# EAGLE schematic axiom_beta_board_100_v0.15_test.94040928 (EAGLE 7.0.0)

## Sheet 1 of 5
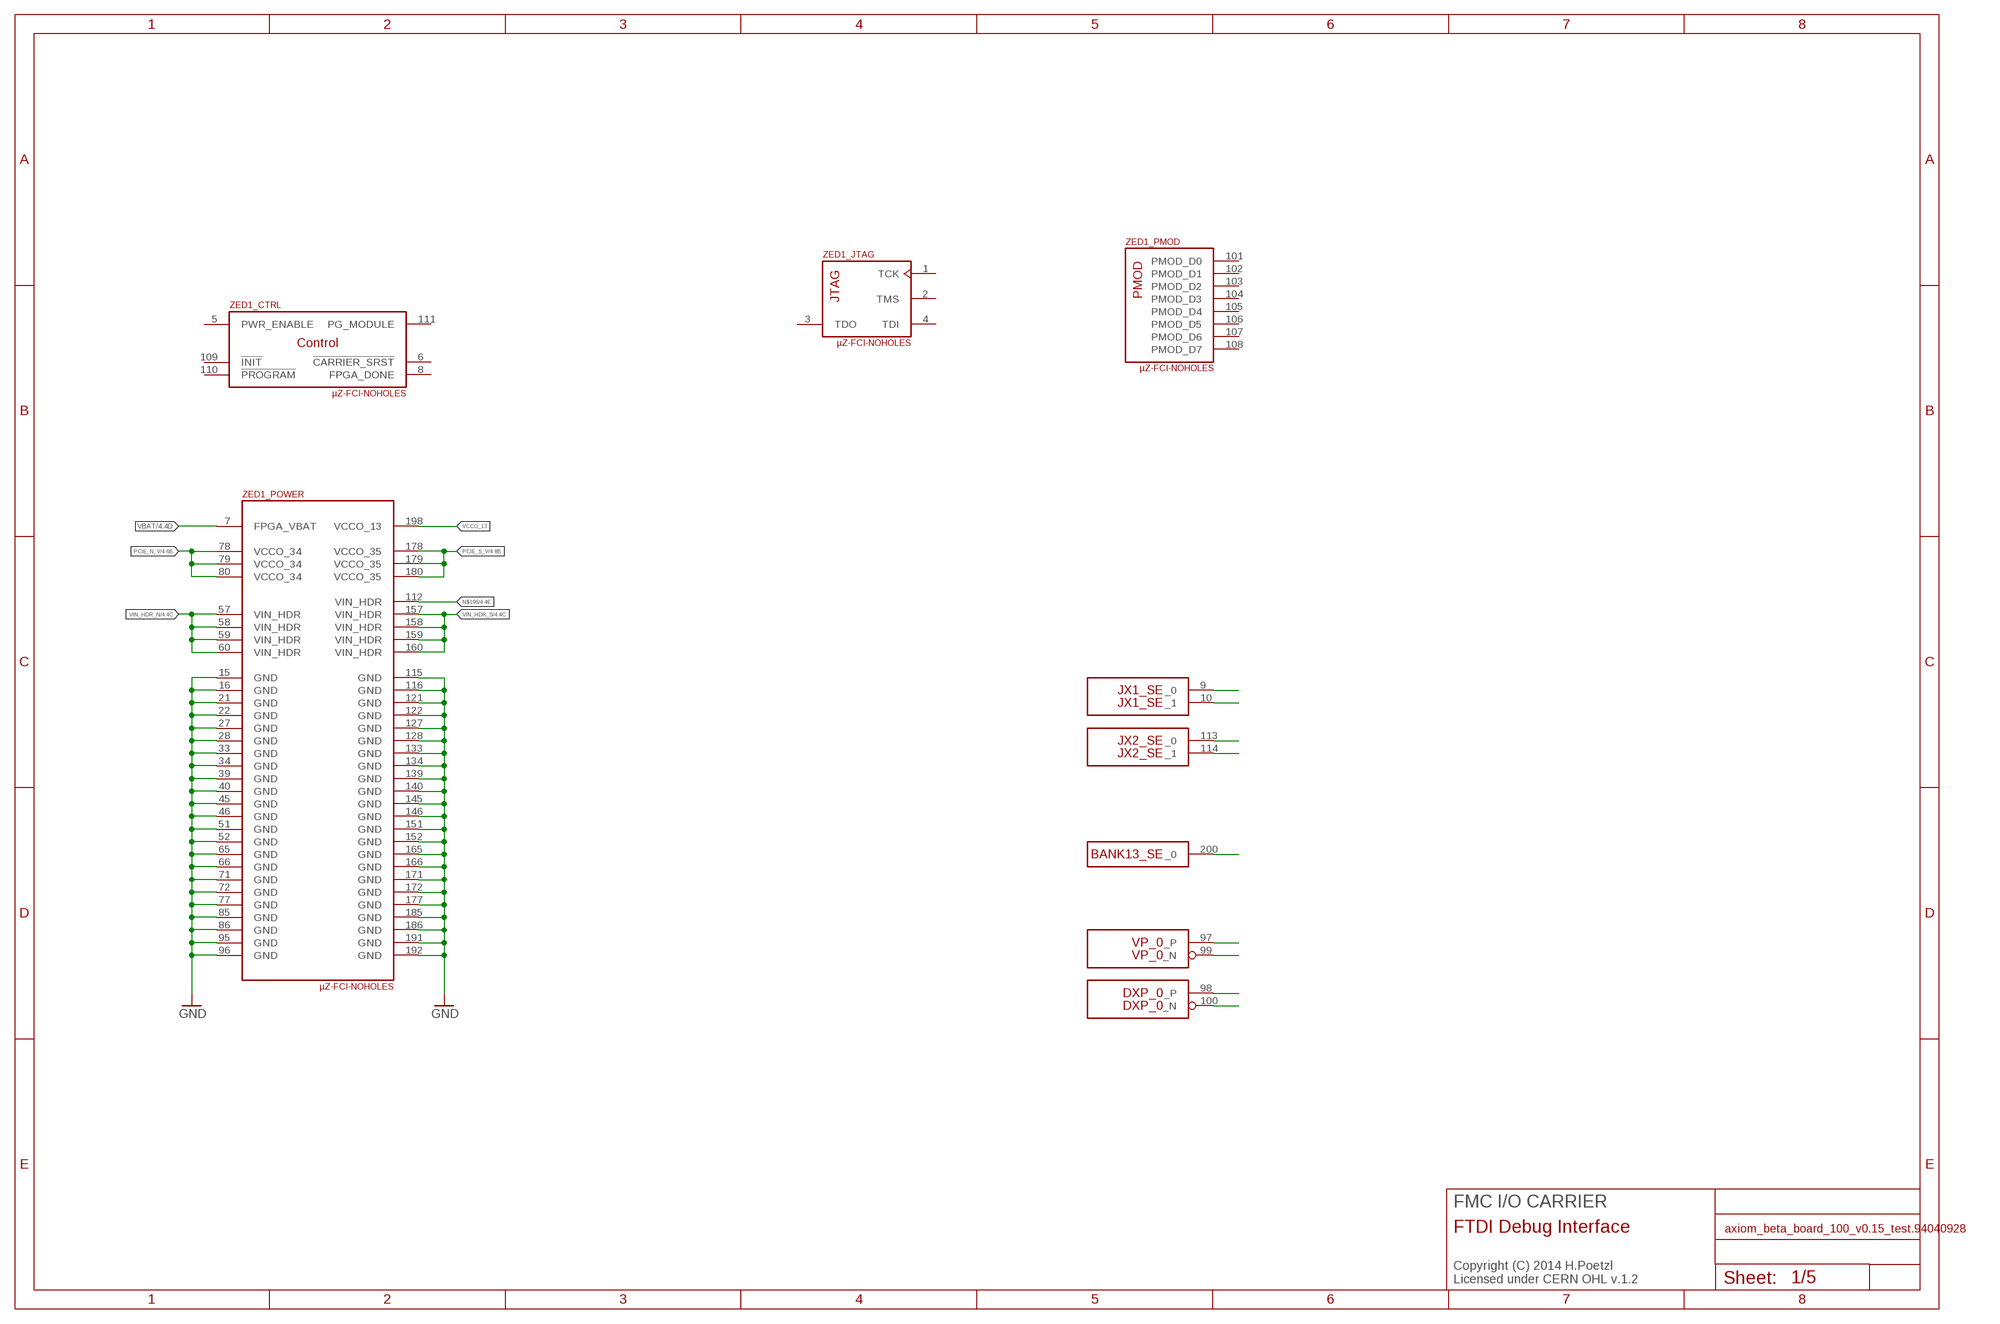
[diagram p0: schematic, sheet 1]

### Parts
ZED1  µZ-FCI-NOHOLES  [µZ-NOHOLES]

### Nets
GND: ZED1.15(_POWER:GND) ZED1.16(_POWER:GND) ZED1.21(_POWER:GND) ZED1.22(_POWER:GND) ZED1.27(_POWER:GND) ZED1.28(_POWER:GND) ZED1.33(_POWER:GND) ZED1.34(_POWER:GND) ZED1.39(_POWER:GND) ZED1.40(_POWER:GND) ZED1.45(_POWER:GND) ZED1.46(_POWER:GND) ZED1.51(_POWER:GND) ZED1.52(_POWER:GND) ZED1.65(_POWER:GND) ZED1.66(_POWER:GND) ZED1.71(_POWER:GND) ZED1.72(_POWER:GND) ZED1.77(_POWER:GND) ZED1.85(_POWER:GND) ZED1.86(_POWER:GND) ZED1.95(_POWER:GND) ZED1.96(_POWER:GND) ZED1.115(_POWER:GND) ZED1.116(_POWER:GND) ZED1.121(_POWER:GND) ZED1.122(_POWER:GND) ZED1.127(_POWER:GND) ZED1.128(_POWER:GND) ZED1.133(_POWER:GND) ZED1.134(_POWER:GND) ZED1.139(_POWER:GND) ZED1.140(_POWER:GND) ZED1.145(_POWER:GND) ZED1.146(_POWER:GND) ZED1.151(_POWER:GND) ZED1.152(_POWER:GND) ZED1.165(_POWER:GND) ZED1.166(_POWER:GND) ZED1.171(_POWER:GND) ZED1.172(_POWER:GND) ZED1.177(_POWER:GND) ZED1.185(_POWER:GND) ZED1.186(_POWER:GND) ZED1.191(_POWER:GND) ZED1.192(_POWER:GND) ; also sheet 3,4,5
N$1: ZED1.9(JX1_SE:_0)
N$46: ZED1.10(JX1_SE:_1)
N$47: ZED1.113(JX2_SE:_0)
N$48: ZED1.114(JX2_SE:_1)
N$49: ZED1.200(BANK13_SE:_0)
N$50: ZED1.97(VP_0:_P)
N$51: ZED1.99(VP_0:_N)
N$52: ZED1.98(DXP_0:_P)
N$53: ZED1.100(DXP_0:_N)
N$106 [power]: ZED1.112(_POWER:VIN_HDR) ; also sheet 4
PCIE_N_V: ZED1.78(_POWER:VCCO_34) ZED1.79(_POWER:VCCO_34) ZED1.80(_POWER:VCCO_34) ; also sheet 4
PCIE_S_V: ZED1.178(_POWER:VCCO_35) ZED1.179(_POWER:VCCO_35) ZED1.180(_POWER:VCCO_35) ; also sheet 4
VBAT: ZED1.7(_POWER:FPGA_VBAT) ; also sheet 4
VCCO_13 [power]: ZED1.198(_POWER:VCCO_13)
VIN_HDR_N [power]: ZED1.57(_POWER:VIN_HDR) ZED1.58(_POWER:VIN_HDR) ZED1.59(_POWER:VIN_HDR) ZED1.60(_POWER:VIN_HDR) ; also sheet 4
VIN_HDR_S [power]: ZED1.157(_POWER:VIN_HDR) ZED1.158(_POWER:VIN_HDR) ZED1.159(_POWER:VIN_HDR) ZED1.160(_POWER:VIN_HDR) ; also sheet 4
Unconnected: ZED1.1(_JTAG:TCK) ZED1.2(_JTAG:TMS) ZED1.3(_JTAG:TDO) ZED1.4(_JTAG:TDI) ZED1.5(_CTRL:PWR_ENABLE) ZED1.6(_CTRL:!CARRIER_SRST) ZED1.8(_CTRL:FPGA_DONE) ZED1.101(_PMOD:PMOD_D0) ZED1.102(_PMOD:PMOD_D1) ZED1.103(_PMOD:PMOD_D2) ZED1.104(_PMOD:PMOD_D3) ZED1.105(_PMOD:PMOD_D4) ZED1.106(_PMOD:PMOD_D5) ZED1.107(_PMOD:PMOD_D6) ZED1.108(_PMOD:PMOD_D7) ZED1.109(_CTRL:!INIT) ZED1.110(_CTRL:!PROGRAM) ZED1.111(_CTRL:PG_MODULE)

### Notes on the sheet
- FMC I/O CARRIER
- FTDI Debug Interface
- Copyright (C) 2014 H.Poetzl
  Licensed under CERN OHL v.1.2

## Sheet 2 of 5
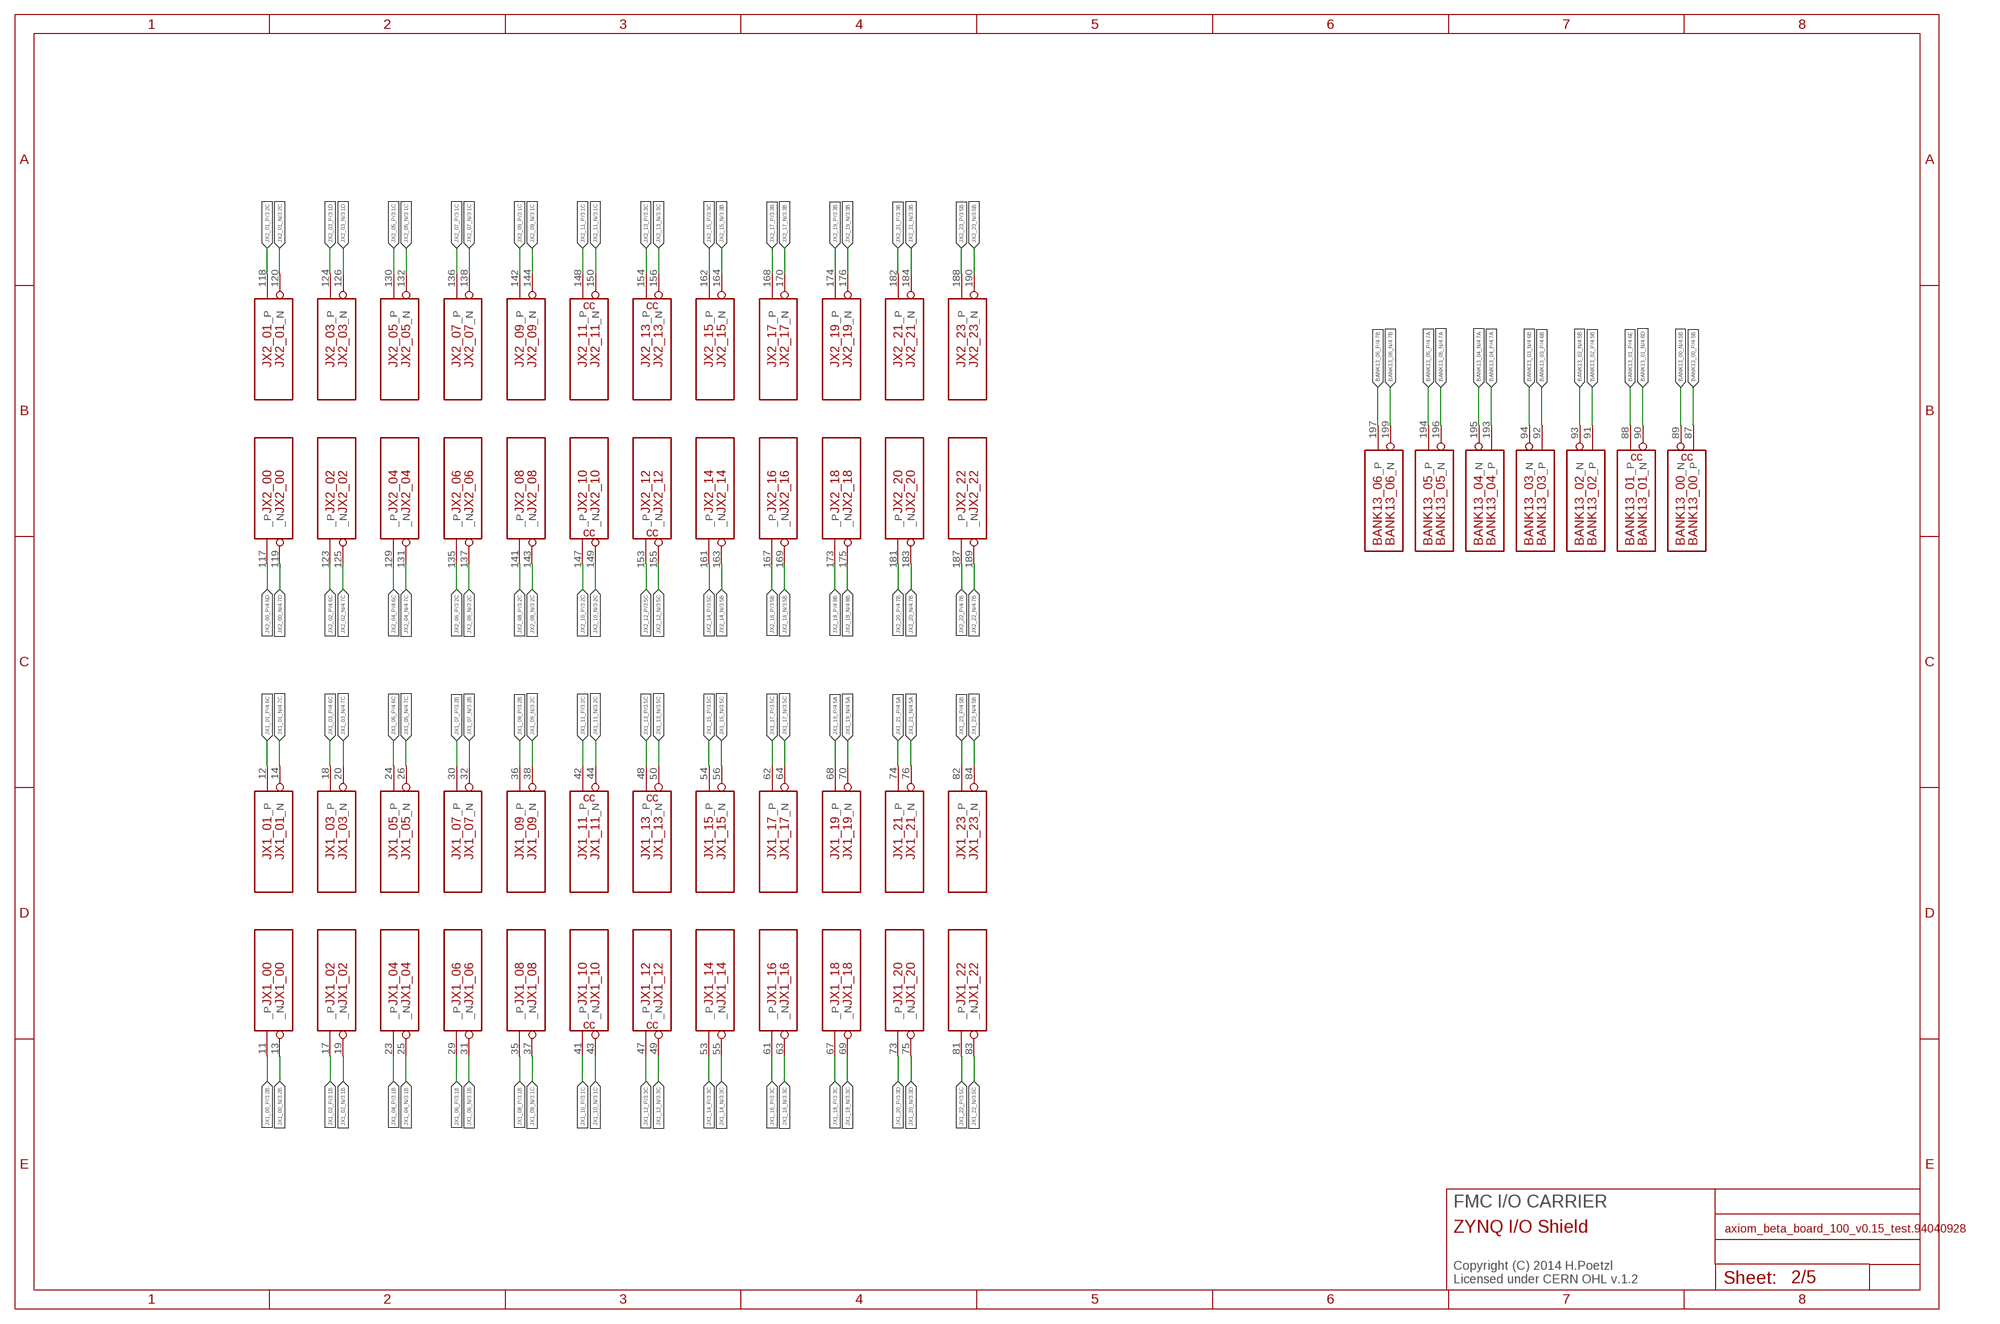
[diagram p1: schematic, sheet 2]

### Nets
BANK13_00_N [power]: ZED1.89(BANK13_00:_N) ; also sheet 4
BANK13_00_P [power]: ZED1.87(BANK13_00:_P) ; also sheet 4
BANK13_01_N [power]: ZED1.90(BANK13_01:_N) ; also sheet 4
BANK13_01_P [power]: ZED1.88(BANK13_01:_P) ; also sheet 4
BANK13_02_N [power]: ZED1.93(BANK13_02:_N) ; also sheet 4
BANK13_02_P [power]: ZED1.91(BANK13_02:_P) ; also sheet 4
BANK13_03_N [power]: ZED1.94(BANK13_03:_N) ; also sheet 4
BANK13_03_P [power]: ZED1.92(BANK13_03:_P) ; also sheet 4
BANK13_04_N [power]: ZED1.195(BANK13_04:_N) ; also sheet 4
BANK13_04_P [power]: ZED1.193(BANK13_04:_P) ; also sheet 4
BANK13_05_N: ZED1.196(BANK13_05:_N) ; also sheet 4
BANK13_05_P: ZED1.194(BANK13_05:_P) ; also sheet 4
BANK13_06_N [power]: ZED1.199(BANK13_06:_N) ; also sheet 4
BANK13_06_P [power]: ZED1.197(BANK13_06:_P) ; also sheet 4
JX1_00_N [power]: ZED1.13(JX1_00:_N) ; also sheet 3
JX1_00_P [power]: ZED1.11(JX1_00:_P) ; also sheet 3
JX1_01_N [power]: ZED1.14(JX1_01:_N) ; also sheet 4
JX1_01_P [power]: ZED1.12(JX1_01:_P) ; also sheet 4
JX1_02_N [power]: ZED1.19(JX1_02:_N) ; also sheet 3
JX1_02_P [power]: ZED1.17(JX1_02:_P) ; also sheet 3
JX1_03_N [power]: ZED1.20(JX1_03:_N) ; also sheet 4
JX1_03_P [power]: ZED1.18(JX1_03:_P) ; also sheet 4
JX1_04_N [power]: ZED1.25(JX1_04:_N) ; also sheet 3
JX1_04_P [power]: ZED1.23(JX1_04:_P) ; also sheet 3
JX1_05_N: ZED1.26(JX1_05:_N) ; also sheet 4
JX1_05_P: ZED1.24(JX1_05:_P) ; also sheet 4
JX1_06_N [power]: ZED1.31(JX1_06:_N) ; also sheet 3
JX1_06_P [power]: ZED1.29(JX1_06:_P) ; also sheet 3
JX1_07_N [power]: ZED1.32(JX1_07:_N) ; also sheet 3
JX1_07_P [power]: ZED1.30(JX1_07:_P) ; also sheet 3
JX1_08_N: ZED1.37(JX1_08:_N) ; also sheet 3
JX1_08_P: ZED1.35(JX1_08:_P) ; also sheet 3
JX1_09_N [power]: ZED1.38(JX1_09:_N) ; also sheet 3
JX1_09_P [power]: ZED1.36(JX1_09:_P) ; also sheet 3
JX1_10_N [power]: ZED1.43(JX1_10:_N) ; also sheet 3
JX1_10_P [power]: ZED1.41(JX1_10:_P) ; also sheet 3
JX1_11_N [power]: ZED1.44(JX1_11:_N) ; also sheet 3
JX1_11_P [power]: ZED1.42(JX1_11:_P) ; also sheet 3
JX1_12_N [power]: ZED1.49(JX1_12:_N) ; also sheet 3
JX1_12_P [power]: ZED1.47(JX1_12:_P) ; also sheet 3
JX1_13_N [power]: ZED1.50(JX1_13:_N) ; also sheet 3
JX1_13_P [power]: ZED1.48(JX1_13:_P) ; also sheet 3
JX1_14_N [power]: ZED1.55(JX1_14:_N) ; also sheet 3
JX1_14_P [power]: ZED1.53(JX1_14:_P) ; also sheet 3
JX1_15_N: ZED1.56(JX1_15:_N) ; also sheet 3
JX1_15_P: ZED1.54(JX1_15:_P) ; also sheet 3
JX1_16_N [power]: ZED1.63(JX1_16:_N) ; also sheet 3
JX1_16_P [power]: ZED1.61(JX1_16:_P) ; also sheet 3
JX1_17_N [power]: ZED1.64(JX1_17:_N) ; also sheet 3
JX1_17_P [power]: ZED1.62(JX1_17:_P) ; also sheet 3
JX1_18_N [power]: ZED1.69(JX1_18:_N) ; also sheet 3
JX1_18_P [power]: ZED1.67(JX1_18:_P) ; also sheet 3
JX1_19_N [power]: ZED1.70(JX1_19:_N) ; also sheet 4
JX1_19_P [power]: ZED1.68(JX1_19:_P) ; also sheet 4
JX1_20_N: ZED1.75(JX1_20:_N) ; also sheet 3
JX1_20_P: ZED1.73(JX1_20:_P) ; also sheet 3
JX1_21_N: ZED1.76(JX1_21:_N) ; also sheet 4
JX1_21_P: ZED1.74(JX1_21:_P) ; also sheet 4
JX1_22_N: ZED1.83(JX1_22:_N) ; also sheet 3
JX1_22_P: ZED1.81(JX1_22:_P) ; also sheet 3
JX1_23_N [power]: ZED1.84(JX1_23:_N) ; also sheet 4
JX1_23_P [power]: ZED1.82(JX1_23:_P) ; also sheet 4
JX2_00_N [power]: ZED1.119(JX2_00:_N) ; also sheet 4
JX2_00_P [power]: ZED1.117(JX2_00:_P) ; also sheet 4
JX2_01_N [power]: ZED1.120(JX2_01:_N) ; also sheet 3
JX2_01_P [power]: ZED1.118(JX2_01:_P) ; also sheet 3
JX2_02_N [power]: ZED1.125(JX2_02:_N) ; also sheet 4
JX2_02_P [power]: ZED1.123(JX2_02:_P) ; also sheet 4
JX2_03_N [power]: ZED1.126(JX2_03:_N) ; also sheet 3
JX2_03_P [power]: ZED1.124(JX2_03:_P) ; also sheet 3
JX2_04_N [power]: ZED1.131(JX2_04:_N) ; also sheet 4
JX2_04_P [power]: ZED1.129(JX2_04:_P) ; also sheet 4
JX2_05_N [power]: ZED1.132(JX2_05:_N) ; also sheet 3
JX2_05_P [power]: ZED1.130(JX2_05:_P) ; also sheet 3
JX2_06_N [power]: ZED1.137(JX2_06:_N) ; also sheet 3
JX2_06_P [power]: ZED1.135(JX2_06:_P) ; also sheet 3
JX2_07_N [power]: ZED1.138(JX2_07:_N) ; also sheet 3
JX2_07_P [power]: ZED1.136(JX2_07:_P) ; also sheet 3
JX2_08_N [power]: ZED1.143(JX2_08:_N) ; also sheet 3
JX2_08_P [power]: ZED1.141(JX2_08:_P) ; also sheet 3
JX2_09_N [power]: ZED1.144(JX2_09:_N) ; also sheet 3
JX2_09_P [power]: ZED1.142(JX2_09:_P) ; also sheet 3
JX2_10_N [power]: ZED1.149(JX2_10:_N) ; also sheet 3
JX2_10_P [power]: ZED1.147(JX2_10:_P) ; also sheet 3
JX2_11_N [power]: ZED1.150(JX2_11:_N) ; also sheet 3
JX2_11_P [power]: ZED1.148(JX2_11:_P) ; also sheet 3
JX2_12_N [power]: ZED1.155(JX2_12:_N) ; also sheet 3
JX2_12_P [power]: ZED1.153(JX2_12:_P) ; also sheet 3
JX2_13_N [power]: ZED1.156(JX2_13:_N) ; also sheet 3
JX2_13_P [power]: ZED1.154(JX2_13:_P) ; also sheet 3
JX2_14_N: ZED1.163(JX2_14:_N) ; also sheet 3
JX2_14_P: ZED1.161(JX2_14:_P) ; also sheet 3
JX2_15_N [power]: ZED1.164(JX2_15:_N) ; also sheet 3
JX2_15_P [power]: ZED1.162(JX2_15:_P) ; also sheet 3
JX2_16_N [power]: ZED1.169(JX2_16:_N) ; also sheet 3
JX2_16_P [power]: ZED1.167(JX2_16:_P) ; also sheet 3
JX2_17_N [power]: ZED1.170(JX2_17:_N) ; also sheet 3
JX2_17_P [power]: ZED1.168(JX2_17:_P) ; also sheet 3
JX2_18_N [power]: ZED1.175(JX2_18:_N) ; also sheet 4
JX2_18_P [power]: ZED1.173(JX2_18:_P) ; also sheet 4
JX2_19_N [power]: ZED1.176(JX2_19:_N) ; also sheet 3
JX2_19_P [power]: ZED1.174(JX2_19:_P) ; also sheet 3
JX2_20_N [power]: ZED1.183(JX2_20:_N) ; also sheet 4
JX2_20_P [power]: ZED1.181(JX2_20:_P) ; also sheet 4
JX2_21_N [power]: ZED1.184(JX2_21:_N) ; also sheet 3
JX2_21_P [power]: ZED1.182(JX2_21:_P) ; also sheet 3
JX2_22_N: ZED1.189(JX2_22:_N) ; also sheet 4
JX2_22_P: ZED1.187(JX2_22:_P) ; also sheet 4
JX2_23_N [power]: ZED1.190(JX2_23:_N) ; also sheet 3
JX2_23_P [power]: ZED1.188(JX2_23:_P) ; also sheet 3

### Notes on the sheet
- FMC I/O CARRIER
- ZYNQ I/O Shield
- Copyright (C) 2014 H.Poetzl
  Licensed under CERN OHL v.1.2

## Sheet 3 of 5
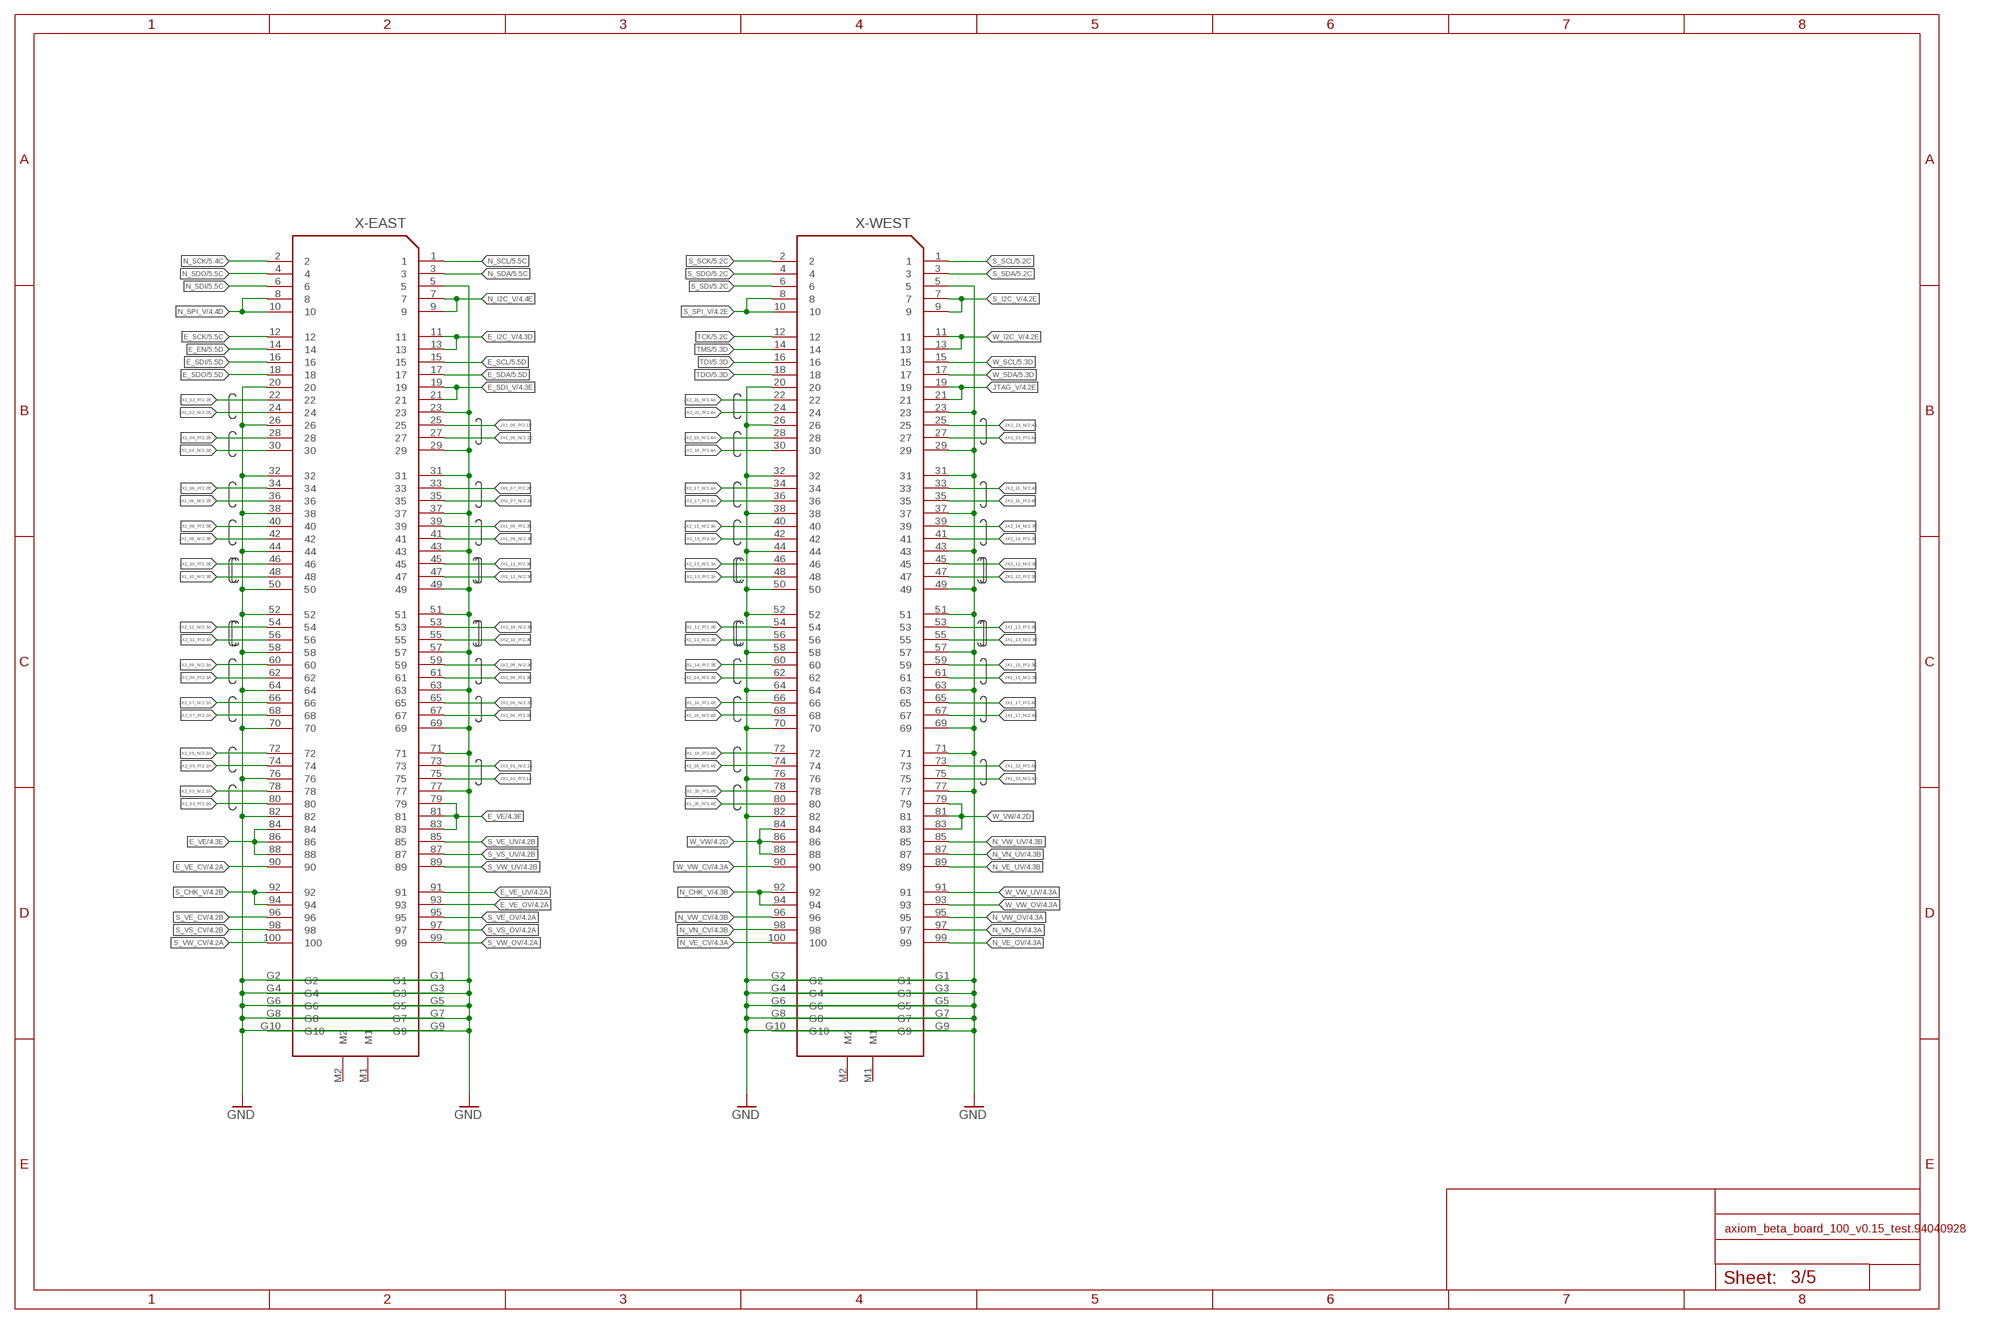
[diagram p2: schematic, sheet 3]

### Parts
X-EAST  FX10-100/10S  [FX10A-100S/10]
X-WEST  FX10-100/10S  [FX10A-100S/10]

### Nets
E_EN: X-EAST.14 ; also sheet 5
E_I2C_V: X-EAST.11 X-EAST.13 ; also sheet 4
E_SCK: X-EAST.12 ; also sheet 5
E_SCL: X-EAST.15 ; also sheet 5
E_SDA: X-EAST.17 ; also sheet 5
E_SDI: X-EAST.16 ; also sheet 5
E_SDI_V: X-EAST.19 X-EAST.21 ; also sheet 4
E_SDO: X-EAST.18 ; also sheet 5
E_VE: X-EAST.79 X-EAST.81 X-EAST.83 X-EAST.84 X-EAST.86 X-EAST.88 ; also sheet 4
E_VE_CV: X-EAST.90 ; also sheet 4
E_VE_OV: X-EAST.93 ; also sheet 4
E_VE_UV: X-EAST.91 ; also sheet 4
GND: X-EAST.5 X-EAST.20 X-EAST.23 X-EAST.26 X-EAST.29 X-EAST.31 X-EAST.32 X-EAST.37 X-EAST.38 X-EAST.43 X-EAST.44 X-EAST.49 X-EAST.50 X-EAST.51 X-EAST.52 X-EAST.57 X-EAST.58 X-EAST.63 X-EAST.64 X-EAST.69 X-EAST.70 X-EAST.71 X-EAST.76 X-EAST.77 X-EAST.82 X-EAST.G1 X-EAST.G2 X-EAST.G3 X-EAST.G4 X-EAST.G5 X-EAST.G6 X-EAST.G7 X-EAST.G8 X-EAST.G9 X-EAST.G10 X-WEST.5 X-WEST.20 X-WEST.23 X-WEST.26 X-WEST.29 X-WEST.31 X-WEST.32 X-WEST.37 X-WEST.38 X-WEST.43 X-WEST.44 X-WEST.49 X-WEST.50 X-WEST.51 X-WEST.52 X-WEST.57 X-WEST.58 X-WEST.63 X-WEST.64 X-WEST.69 X-WEST.70 X-WEST.71 X-WEST.76 X-WEST.77 X-WEST.82 X-WEST.G1 X-WEST.G2 X-WEST.G3 X-WEST.G4 X-WEST.G5 X-WEST.G6 X-WEST.G7 X-WEST.G8 X-WEST.G9 X-WEST.G10 ; also sheet 1,4,5
JTAG_V: X-WEST.19 X-WEST.21 ; also sheet 4
JX1_00_N [power]: X-EAST.27 ; also sheet 2
JX1_00_P [power]: X-EAST.25 ; also sheet 2
JX1_02_N [power]: X-EAST.24 ; also sheet 2
JX1_02_P [power]: X-EAST.22 ; also sheet 2
JX1_04_N [power]: X-EAST.30 ; also sheet 2
JX1_04_P [power]: X-EAST.28 ; also sheet 2
JX1_06_N [power]: X-EAST.36 ; also sheet 2
JX1_06_P [power]: X-EAST.34 ; also sheet 2
JX1_07_N [power]: X-EAST.35 ; also sheet 2
JX1_07_P [power]: X-EAST.33 ; also sheet 2
JX1_08_N: X-EAST.42 ; also sheet 2
JX1_08_P: X-EAST.40 ; also sheet 2
JX1_09_N [power]: X-EAST.41 ; also sheet 2
JX1_09_P [power]: X-EAST.39 ; also sheet 2
JX1_10_N [power]: X-EAST.48 ; also sheet 2
JX1_10_P [power]: X-EAST.46 ; also sheet 2
JX1_11_N [power]: X-EAST.47 ; also sheet 2
JX1_11_P [power]: X-EAST.45 ; also sheet 2
JX1_12_N [power]: X-WEST.56 ; also sheet 2
JX1_12_P [power]: X-WEST.54 ; also sheet 2
JX1_13_N [power]: X-WEST.55 ; also sheet 2
JX1_13_P [power]: X-WEST.53 ; also sheet 2
JX1_14_N [power]: X-WEST.62 ; also sheet 2
JX1_14_P [power]: X-WEST.60 ; also sheet 2
JX1_15_N: X-WEST.61 ; also sheet 2
JX1_15_P: X-WEST.59 ; also sheet 2
JX1_16_N [power]: X-WEST.68 ; also sheet 2
JX1_16_P [power]: X-WEST.66 ; also sheet 2
JX1_17_N [power]: X-WEST.67 ; also sheet 2
JX1_17_P [power]: X-WEST.65 ; also sheet 2
JX1_18_N [power]: X-WEST.74 ; also sheet 2
JX1_18_P [power]: X-WEST.72 ; also sheet 2
JX1_20_N: X-WEST.80 ; also sheet 2
JX1_20_P: X-WEST.78 ; also sheet 2
JX1_22_N: X-WEST.75 ; also sheet 2
JX1_22_P: X-WEST.73 ; also sheet 2
JX2_01_N [power]: X-EAST.73 ; also sheet 2
JX2_01_P [power]: X-EAST.75 ; also sheet 2
JX2_03_N [power]: X-EAST.78 ; also sheet 2
JX2_03_P [power]: X-EAST.80 ; also sheet 2
JX2_05_N [power]: X-EAST.72 ; also sheet 2
JX2_05_P [power]: X-EAST.74 ; also sheet 2
JX2_06_N [power]: X-EAST.65 ; also sheet 2
JX2_06_P [power]: X-EAST.67 ; also sheet 2
JX2_07_N [power]: X-EAST.66 ; also sheet 2
JX2_07_P [power]: X-EAST.68 ; also sheet 2
JX2_08_N [power]: X-EAST.59 ; also sheet 2
JX2_08_P [power]: X-EAST.61 ; also sheet 2
JX2_09_N [power]: X-EAST.60 ; also sheet 2
JX2_09_P [power]: X-EAST.62 ; also sheet 2
JX2_10_N [power]: X-EAST.53 ; also sheet 2
JX2_10_P [power]: X-EAST.55 ; also sheet 2
JX2_11_N [power]: X-EAST.54 ; also sheet 2
JX2_11_P [power]: X-EAST.56 ; also sheet 2
JX2_12_N [power]: X-WEST.45 ; also sheet 2
JX2_12_P [power]: X-WEST.47 ; also sheet 2
JX2_13_N [power]: X-WEST.46 ; also sheet 2
JX2_13_P [power]: X-WEST.48 ; also sheet 2
JX2_14_N: X-WEST.39 ; also sheet 2
JX2_14_P: X-WEST.41 ; also sheet 2
JX2_15_N [power]: X-WEST.40 ; also sheet 2
JX2_15_P [power]: X-WEST.42 ; also sheet 2
JX2_16_N [power]: X-WEST.33 ; also sheet 2
JX2_16_P [power]: X-WEST.35 ; also sheet 2
JX2_17_N [power]: X-WEST.34 ; also sheet 2
JX2_17_P [power]: X-WEST.36 ; also sheet 2
JX2_19_N [power]: X-WEST.28 ; also sheet 2
JX2_19_P [power]: X-WEST.30 ; also sheet 2
JX2_21_N [power]: X-WEST.22 ; also sheet 2
JX2_21_P [power]: X-WEST.24 ; also sheet 2
JX2_23_N [power]: X-WEST.25 ; also sheet 2
JX2_23_P [power]: X-WEST.27 ; also sheet 2
N_CHK_V: X-WEST.92 X-WEST.94 ; also sheet 4
N_I2C_V: X-EAST.7 X-EAST.9 ; also sheet 4
N_SCK: X-EAST.2 ; also sheet 5
N_SCL: X-EAST.1 ; also sheet 5
N_SDA: X-EAST.3 ; also sheet 5
N_SDI: X-EAST.6 ; also sheet 5
N_SDO: X-EAST.4 ; also sheet 5
N_SPI_V: X-EAST.8 X-EAST.10 ; also sheet 4
N_VE_CV: X-WEST.100 ; also sheet 4
N_VE_OV: X-WEST.99 ; also sheet 4
N_VE_UV: X-WEST.89 ; also sheet 4
N_VN_CV: X-WEST.98 ; also sheet 4
N_VN_OV: X-WEST.97 ; also sheet 4
N_VN_UV: X-WEST.87 ; also sheet 4
N_VW_CV: X-WEST.96 ; also sheet 4
N_VW_OV: X-WEST.95 ; also sheet 4
N_VW_UV: X-WEST.85 ; also sheet 4
S_CHK_V: X-EAST.92 X-EAST.94 ; also sheet 4
S_I2C_V: X-WEST.7 X-WEST.9 ; also sheet 4
S_SCK: X-WEST.2 ; also sheet 5
S_SCL: X-WEST.1 ; also sheet 5
S_SDA: X-WEST.3 ; also sheet 5
S_SDI: X-WEST.6 ; also sheet 5
S_SDO: X-WEST.4 ; also sheet 5
S_SPI_V: X-WEST.8 X-WEST.10 ; also sheet 4
S_VE_CV: X-EAST.96 ; also sheet 4
S_VE_OV: X-EAST.95 ; also sheet 4
S_VE_UV: X-EAST.85 ; also sheet 4
S_VS_CV: X-EAST.98 ; also sheet 4
S_VS_OV: X-EAST.97 ; also sheet 4
S_VS_UV: X-EAST.87 ; also sheet 4
S_VW_CV: X-EAST.100 ; also sheet 4
S_VW_OV: X-EAST.99 ; also sheet 4
S_VW_UV: X-EAST.89 ; also sheet 4
TCK: X-WEST.12 ; also sheet 5
TDI: X-WEST.16 ; also sheet 5
TDO: X-WEST.18 ; also sheet 5
TMS: X-WEST.14 ; also sheet 5
W_I2C_V: X-WEST.11 X-WEST.13 ; also sheet 4
W_SCL: X-WEST.15 ; also sheet 5
W_SDA: X-WEST.17 ; also sheet 5
W_VW: X-WEST.79 X-WEST.81 X-WEST.83 X-WEST.84 X-WEST.86 X-WEST.88 ; also sheet 4
W_VW_CV: X-WEST.90 ; also sheet 4
W_VW_OV: X-WEST.93 ; also sheet 4
W_VW_UV: X-WEST.91 ; also sheet 4
Unconnected: X-EAST.M1 X-EAST.M2 X-WEST.M1 X-WEST.M2

## Sheet 4 of 5
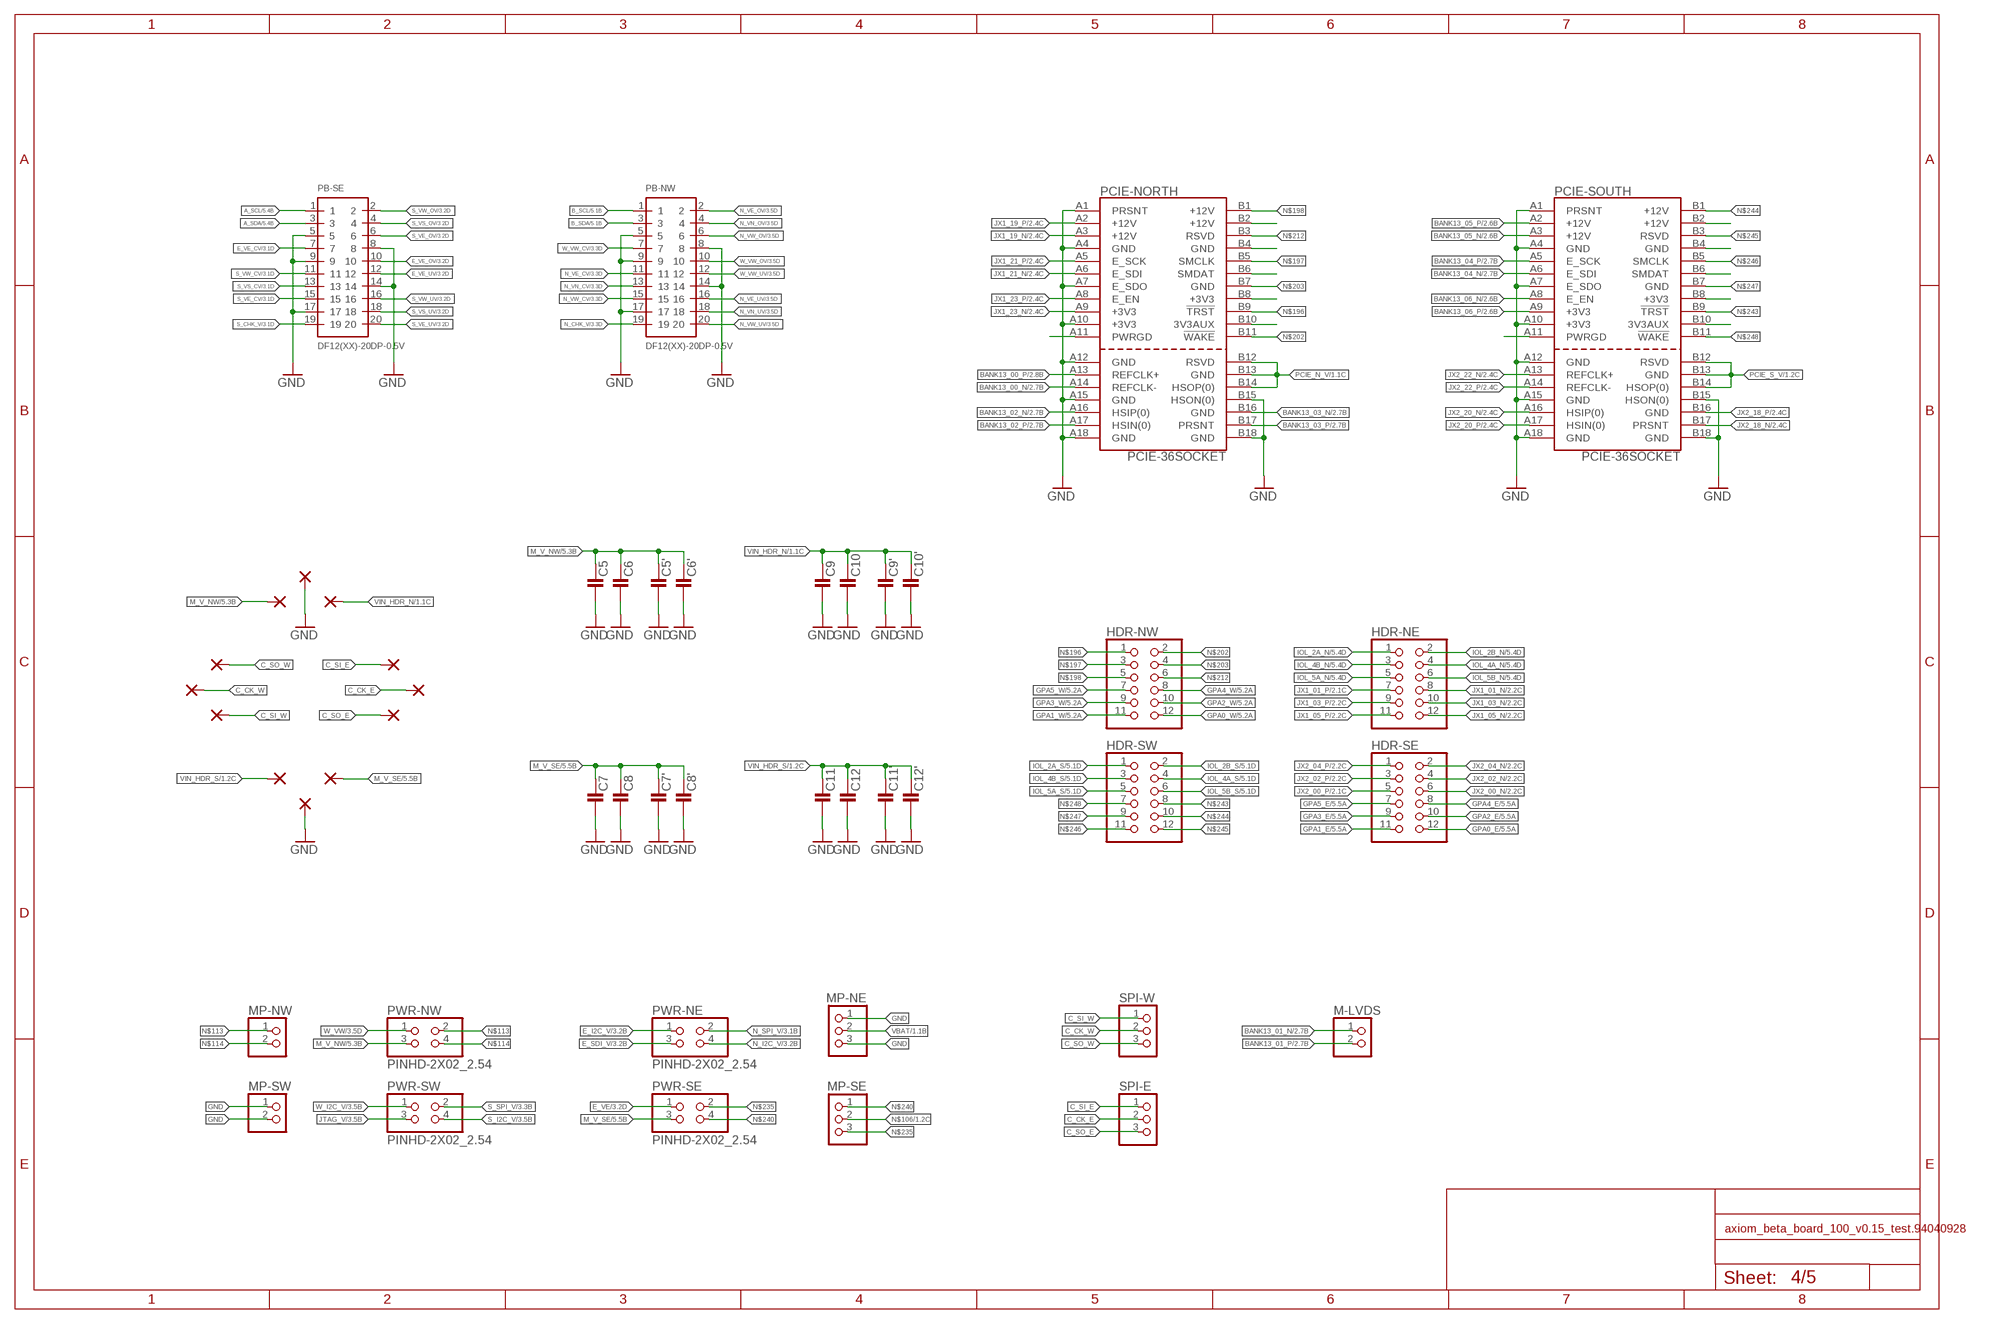
[diagram p3: schematic, sheet 4]

### Parts
C5  C0805-A  [0805-A]
C5'  C0805-A  [0805-A]
C6  C0603-A  [0603-A]
C6'  C0603-A  [0603-A]
C7  C0805-A  [0805-A]
C7'  C0805-A  [0805-A]
C8  C0603-A  [0603-A]
C8'  C0603-A  [0603-A]
C9  C0805-A  [0805-A]
C9'  C0805-A  [0805-A]
C10  C0603-A  [0603-A]
C10'  C0603-A  [0603-A]
C11  C0805-A  [0805-A]
C11'  C0805-A  [0805-A]
C12  C0603-A  [0603-A]
C12'  C0603-A  [0603-A]
HDR-NE  PINHD-2X06_2.00  [2X06M]
HDR-NW  PINHD-2X06_2.00  [2X06M]
HDR-SE  PINHD-2X06_2.00  [2X06M]
HDR-SW  PINHD-2X06_2.00  [2X06M]
M-LVDS  PINHD-1X02_2.00  [1X02M]
MP-NE  PINHD-1X03_2.00  [1X03M]
MP-NW  PINHD-1X02_2.00  [1X02M]
MP-SE  PINHD-1X03_2.00  [1X03M]
MP-SW  PINHD-1X02_2.00  [1X02M]
PB-NW  DF12(XX)-20DP-0.5V  [DF12(XX)-20DP-0.5V]
PB-SE  DF12(XX)-20DP-0.5V  [DF12(XX)-20DP-0.5V]
PCIE-NORTH  PCIE-36SOCKET  [PCIE-36]
PCIE-SOUTH  PCIE-36SOCKET  [PCIE-36]
PWR-NE  PINHD-2X02_2.54  [2X02]
PWR-NW  PINHD-2X02_2.54  [2X02]
PWR-SE  PINHD-2X02_2.54  [2X02]
PWR-SW  PINHD-2X02_2.54  [2X02]
SPI-E  PINHD-2X02_2.00  PINHD-1X03_2.00  [1X03M]
SPI-W  PINHD-2X02_2.00  PINHD-1X03_2.00  [1X03M]
U$1  PINPAD1.27MM  [1.2/0.6]
U$2  PINPAD1.27MM  [1.2/0.6]
U$11  PINPAD1.27MM  [1.2/0.6]
U$14  PINPAD1.27MM  [1.2/0.6]
U$15  PINPAD1.27MM  [1.2/0.6]
U$16  PINPAD1.27MM  [1.2/0.6]
U$17  PINPAD1.27MM  [1.2/0.6]
U$18  PINPAD1.27MM  [1.2/0.6]
U$19  PINPAD1.27MM  [1.2/0.6]
U$20  PINPAD1.27MM  [1.2/0.6]
U$21  PINPAD1.27MM  [1.2/0.6]
U$22  PINPAD1.27MM  [1.2/0.6]

### Nets
A_SCL: PB-SE.1 ; also sheet 5
A_SDA: PB-SE.3 ; also sheet 5
B_SCL: PB-NW.1 ; also sheet 5
B_SDA: PB-NW.3 ; also sheet 5
BANK13_00_N [power]: PCIE-NORTH.A14(REFCLK-) ; also sheet 2
BANK13_00_P [power]: PCIE-NORTH.A13(REFCLK+) ; also sheet 2
BANK13_01_N [power]: M-LVDS.1 ; also sheet 2
BANK13_01_P [power]: M-LVDS.2 ; also sheet 2
BANK13_02_N [power]: PCIE-NORTH.A16(HSIP(0)) ; also sheet 2
BANK13_02_P [power]: PCIE-NORTH.A17(HSIN(0)) ; also sheet 2
BANK13_03_N [power]: PCIE-NORTH.B16(GND) ; also sheet 2
BANK13_03_P [power]: PCIE-NORTH.B17(PRSNT) ; also sheet 2
BANK13_04_N [power]: PCIE-SOUTH.A6(E_SDI) ; also sheet 2
BANK13_04_P [power]: PCIE-SOUTH.A5(E_SCK) ; also sheet 2
BANK13_05_N: PCIE-SOUTH.A3(+12V) ; also sheet 2
BANK13_05_P: PCIE-SOUTH.A2(+12V) ; also sheet 2
BANK13_06_N [power]: PCIE-SOUTH.A8(E_EN) ; also sheet 2
BANK13_06_P [power]: PCIE-SOUTH.A9(+3V3) ; also sheet 2
C_CK_E: SPI-E.2 U$14.1(P)
C_CK_W: SPI-W.2 U$1.1(P)
C_SI_E: SPI-E.1 U$15.1(P)
C_SI_W: SPI-W.1 U$2.1(P)
C_SO_E: SPI-E.3 U$16.1(P)
C_SO_W: SPI-W.3 U$11.1(P)
E_I2C_V: PWR-NE.1 ; also sheet 3
E_SDI_V: PWR-NE.3 ; also sheet 3
E_VE: PWR-SE.1 ; also sheet 3
E_VE_CV: PB-SE.7 ; also sheet 3
E_VE_OV: PB-SE.10 ; also sheet 3
E_VE_UV: PB-SE.12 ; also sheet 3
GND: C5'.2 C5.2 C6'.2 C6.2 C7'.2 C7.2 C8'.2 C8.2 C9'.2 C9.2 C10'.2 C10.2 C11'.2 C11.2 C12'.2 C12.2 MP-NE.1 MP-NE.3 MP-SW.1 MP-SW.2 PB-NW.5 PB-NW.8 PB-NW.9 PB-NW.14 PB-NW.17 PB-SE.5 PB-SE.8 PB-SE.9 PB-SE.14 PB-SE.17 PCIE-NORTH.A1(PRSNT) PCIE-NORTH.A4(GND) PCIE-NORTH.A7(E_SDO) PCIE-NORTH.A10(+3V3) PCIE-NORTH.A12(GND) PCIE-NORTH.A15(GND) PCIE-NORTH.A18(GND) PCIE-NORTH.B15(HSON(0)) PCIE-NORTH.B18(GND) PCIE-SOUTH.A1(PRSNT) PCIE-SOUTH.A4(GND) PCIE-SOUTH.A7(E_SDO) PCIE-SOUTH.A10(+3V3) PCIE-SOUTH.A12(GND) PCIE-SOUTH.A15(GND) PCIE-SOUTH.A18(GND) PCIE-SOUTH.B15(HSON(0)) PCIE-SOUTH.B18(GND) U$17.1(P) U$20.1(P) ; also sheet 1,3,5
GPA0_E: HDR-SE.12 ; also sheet 5
GPA0_W: HDR-NW.12 ; also sheet 5
GPA1_E: HDR-SE.11 ; also sheet 5
GPA1_W: HDR-NW.11 ; also sheet 5
GPA2_E: HDR-SE.10 ; also sheet 5
GPA2_W: HDR-NW.10 ; also sheet 5
GPA3_E: HDR-SE.9 ; also sheet 5
GPA3_W: HDR-NW.9 ; also sheet 5
GPA4_E: HDR-SE.8 ; also sheet 5
GPA4_W: HDR-NW.8 ; also sheet 5
GPA5_E: HDR-SE.7 ; also sheet 5
GPA5_W: HDR-NW.7 ; also sheet 5
IOL_2A_N: HDR-NE.1 ; also sheet 5
IOL_2A_S: HDR-SW.1 ; also sheet 5
IOL_2B_N: HDR-NE.2 ; also sheet 5
IOL_2B_S: HDR-SW.2 ; also sheet 5
IOL_4A_N: HDR-NE.4 ; also sheet 5
IOL_4A_S: HDR-SW.4 ; also sheet 5
IOL_4B_N: HDR-NE.3 ; also sheet 5
IOL_4B_S: HDR-SW.3 ; also sheet 5
IOL_5A_N: HDR-NE.5 ; also sheet 5
IOL_5A_S: HDR-SW.5 ; also sheet 5
IOL_5B_N: HDR-NE.6 ; also sheet 5
IOL_5B_S: HDR-SW.6 ; also sheet 5
JTAG_V: PWR-SW.3 ; also sheet 3
JX1_01_N [power]: HDR-NE.8 ; also sheet 2
JX1_01_P [power]: HDR-NE.7 ; also sheet 2
JX1_03_N [power]: HDR-NE.10 ; also sheet 2
JX1_03_P [power]: HDR-NE.9 ; also sheet 2
JX1_05_N: HDR-NE.12 ; also sheet 2
JX1_05_P: HDR-NE.11 ; also sheet 2
JX1_19_N [power]: PCIE-NORTH.A3(+12V) ; also sheet 2
JX1_19_P [power]: PCIE-NORTH.A2(+12V) ; also sheet 2
JX1_21_N: PCIE-NORTH.A6(E_SDI) ; also sheet 2
JX1_21_P: PCIE-NORTH.A5(E_SCK) ; also sheet 2
JX1_23_N [power]: PCIE-NORTH.A9(+3V3) ; also sheet 2
JX1_23_P [power]: PCIE-NORTH.A8(E_EN) ; also sheet 2
JX2_00_N [power]: HDR-SE.6 ; also sheet 2
JX2_00_P [power]: HDR-SE.5 ; also sheet 2
JX2_02_N [power]: HDR-SE.4 ; also sheet 2
JX2_02_P [power]: HDR-SE.3 ; also sheet 2
JX2_04_N [power]: HDR-SE.2 ; also sheet 2
JX2_04_P [power]: HDR-SE.1 ; also sheet 2
JX2_18_N [power]: PCIE-SOUTH.B17(PRSNT) ; also sheet 2
JX2_18_P [power]: PCIE-SOUTH.B16(GND) ; also sheet 2
JX2_20_N [power]: PCIE-SOUTH.A16(HSIP(0)) ; also sheet 2
JX2_20_P [power]: PCIE-SOUTH.A17(HSIN(0)) ; also sheet 2
JX2_22_N: PCIE-SOUTH.A13(REFCLK+) ; also sheet 2
JX2_22_P: PCIE-SOUTH.A14(REFCLK-) ; also sheet 2
M_V_NW: C5'.1 C5.1 C6'.1 C6.1 PWR-NW.3 U$18.1(P) ; also sheet 5
M_V_SE: C7'.1 C7.1 C8'.1 C8.1 PWR-SE.3 U$21.1(P) ; also sheet 5
N$106 [power]: MP-SE.2 ; also sheet 1
N$113: MP-NW.1 PWR-NW.2
N$114: MP-NW.2 PWR-NW.4
N$196: HDR-NW.1 PCIE-NORTH.B9(!TRST)
N$197: HDR-NW.3 PCIE-NORTH.B5(SMCLK)
N$198: HDR-NW.5 PCIE-NORTH.B1(+12V)
N$202: HDR-NW.2 PCIE-NORTH.B11(!WAKE)
N$203: HDR-NW.4 PCIE-NORTH.B7(GND)
N$209: PCIE-SOUTH.A11(PWRGD)
N$211: PCIE-SOUTH.B2(+12V)
N$212: HDR-NW.6 PCIE-NORTH.B3(RSVD)
N$214: PCIE-SOUTH.B4(GND)
N$216: PCIE-SOUTH.B6(SMDAT)
N$218: PCIE-SOUTH.B8(+3V3)
N$220: PCIE-SOUTH.B10(3V3AUX)
N$223: PCIE-NORTH.B10(3V3AUX)
N$226: PCIE-NORTH.B8(+3V3)
N$233: PCIE-NORTH.B6(SMDAT)
N$235: MP-SE.3 PWR-SE.2
N$236: PCIE-NORTH.B4(GND)
N$238: PCIE-NORTH.B2(+12V)
N$240: MP-SE.1 PWR-SE.4
N$243: HDR-SW.8 PCIE-SOUTH.B9(!TRST)
N$244: HDR-SW.10 PCIE-SOUTH.B1(+12V)
N$245: HDR-SW.12 PCIE-SOUTH.B3(RSVD)
N$246: HDR-SW.11 PCIE-SOUTH.B5(SMCLK)
N$247: HDR-SW.9 PCIE-SOUTH.B7(GND)
N$248: HDR-SW.7 PCIE-SOUTH.B11(!WAKE)
N$256: PCIE-NORTH.A11(PWRGD)
N_CHK_V: PB-NW.19 ; also sheet 3
N_I2C_V: PWR-NE.4 ; also sheet 3
N_SPI_V: PWR-NE.2 ; also sheet 3
N_VE_CV: PB-NW.11 ; also sheet 3
N_VE_OV: PB-NW.2 ; also sheet 3
N_VE_UV: PB-NW.16 ; also sheet 3
N_VN_CV: PB-NW.13 ; also sheet 3
N_VN_OV: PB-NW.4 ; also sheet 3
N_VN_UV: PB-NW.18 ; also sheet 3
N_VW_CV: PB-NW.15 ; also sheet 3
N_VW_OV: PB-NW.6 ; also sheet 3
N_VW_UV: PB-NW.20 ; also sheet 3
PCIE_N_V: PCIE-NORTH.B12(RSVD) PCIE-NORTH.B13(GND) PCIE-NORTH.B14(HSOP(0)) ; also sheet 1
PCIE_S_V: PCIE-SOUTH.B12(RSVD) PCIE-SOUTH.B13(GND) PCIE-SOUTH.B14(HSOP(0)) ; also sheet 1
S_CHK_V: PB-SE.19 ; also sheet 3
S_I2C_V: PWR-SW.4 ; also sheet 3
S_SPI_V: PWR-SW.2 ; also sheet 3
S_VE_CV: PB-SE.15 ; also sheet 3
S_VE_OV: PB-SE.6 ; also sheet 3
S_VE_UV: PB-SE.20 ; also sheet 3
S_VS_CV: PB-SE.13 ; also sheet 3
S_VS_OV: PB-SE.4 ; also sheet 3
S_VS_UV: PB-SE.18 ; also sheet 3
S_VW_CV: PB-SE.11 ; also sheet 3
S_VW_OV: PB-SE.2 ; also sheet 3
S_VW_UV: PB-SE.16 ; also sheet 3
VBAT: MP-NE.2 ; also sheet 1
VIN_HDR_N [power]: C9'.1 C9.1 C10'.1 C10.1 U$19.1(P) ; also sheet 1
VIN_HDR_S [power]: C11'.1 C11.1 C12'.1 C12.1 U$22.1(P) ; also sheet 1
W_I2C_V: PWR-SW.1 ; also sheet 3
W_VW: PWR-NW.1 ; also sheet 3
W_VW_CV: PB-NW.7 ; also sheet 3
W_VW_OV: PB-NW.10 ; also sheet 3
W_VW_UV: PB-NW.12 ; also sheet 3

## Sheet 5 of 5
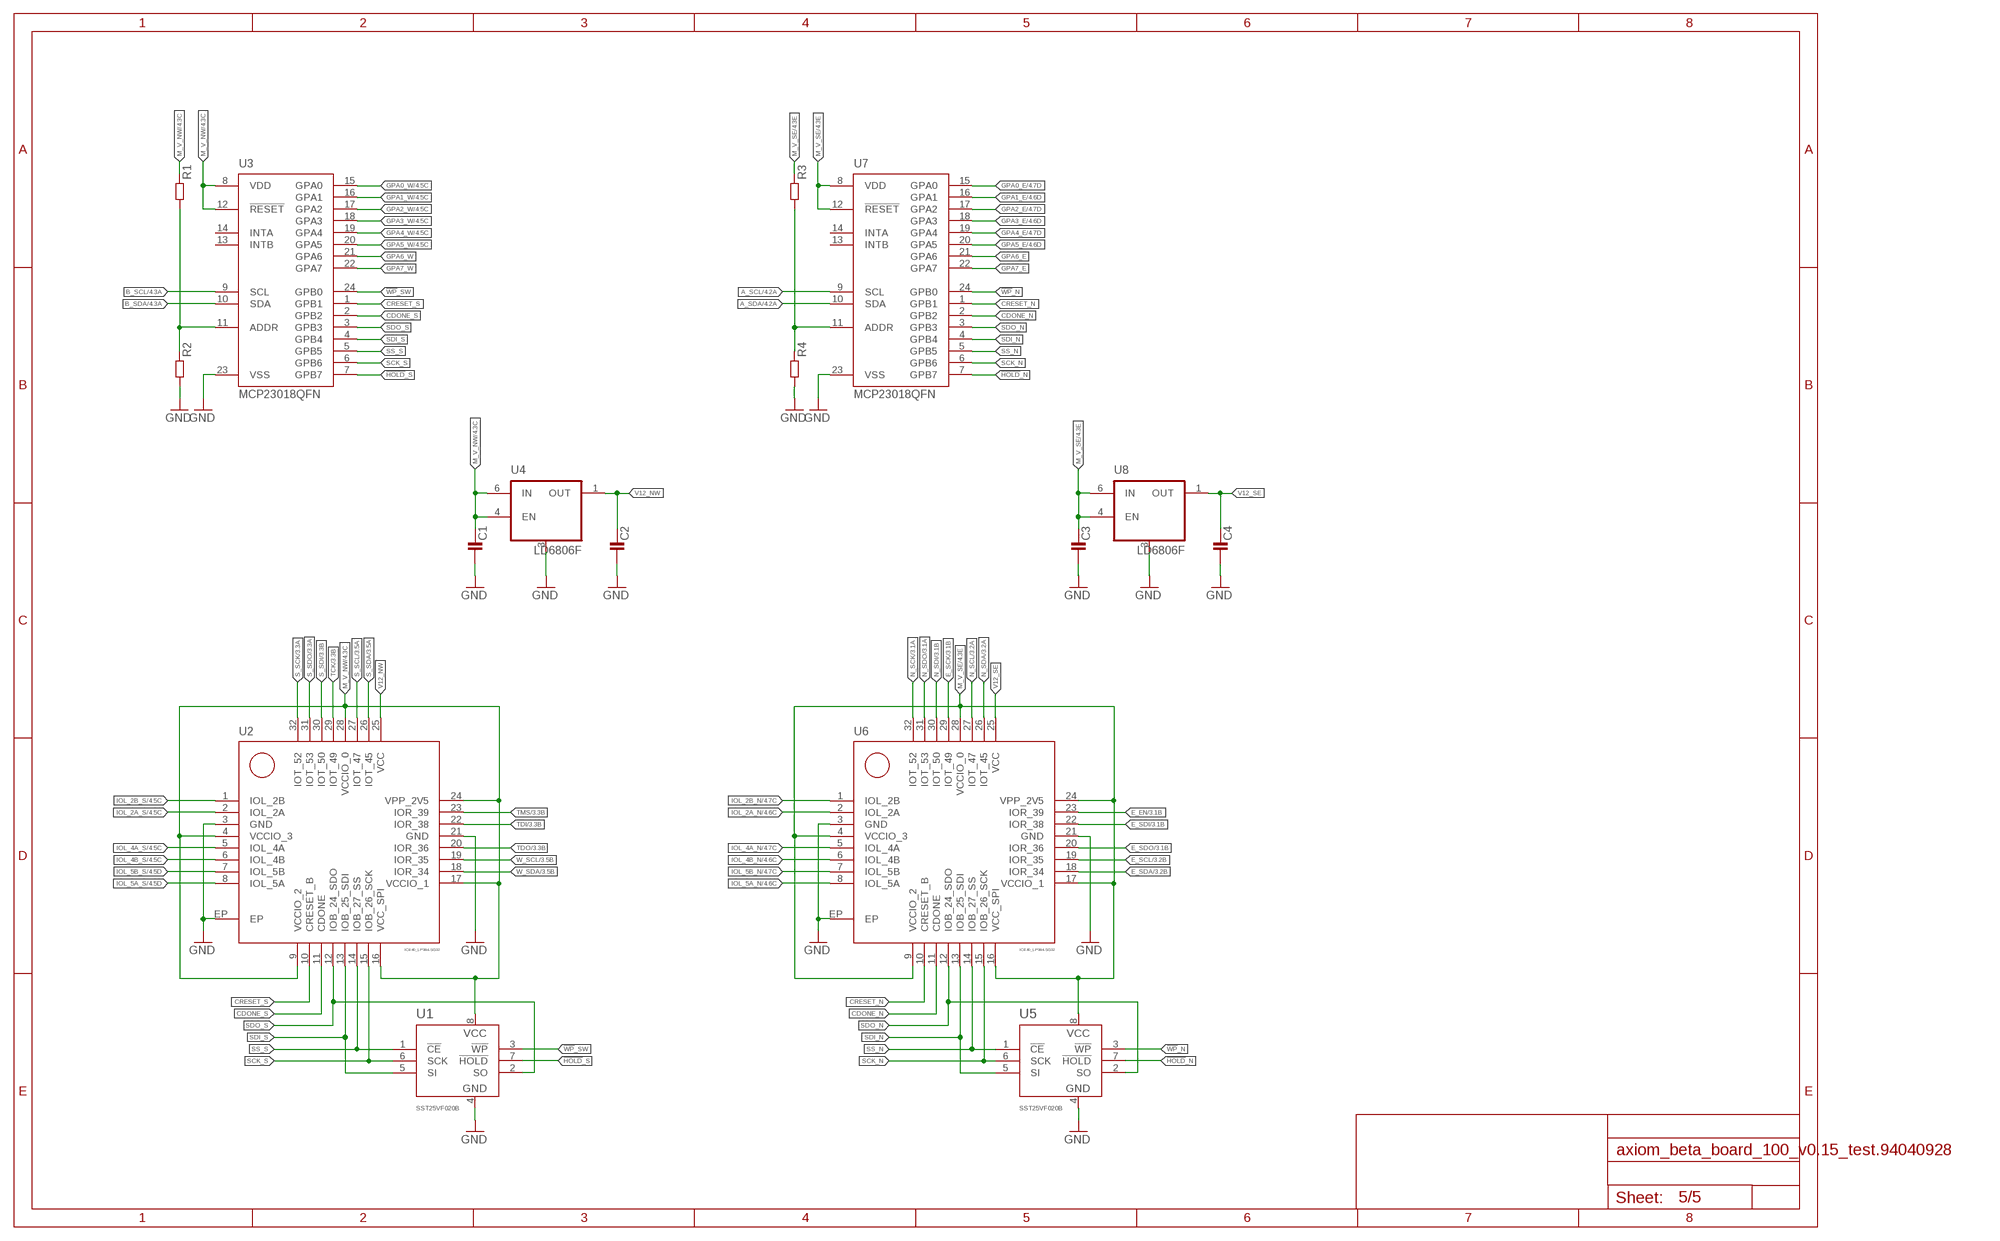
[diagram p4: schematic, sheet 5]

### Parts
C1  C0402-B  [0402-B]
C2  C0402-B  [0402-B]
C3  C0402-B  [0402-B]
C4  C0402-B  [0402-B]
R1  R0402-B  [0402-B]
R2  R0402-B  [0402-B]
R3  R0402-B  [0402-B]
R4  R0402-B  [0402-B]
U1  SST25VF020B  [SOIC127P600X175-8N]
U2  ICE40_LP384-SG32  [QFN-32]
U3  MCP23018QFN  [QFN50P400X400X80-25N]
U4  LD6806F  [DFN100X150X50-6N]
U5  SST25VF020B  [SOIC127P600X175-8N]
U6  ICE40_LP384-SG32  [QFN-32]
U7  MCP23018QFN  [QFN50P400X400X80-25N]
U8  LD6806F  [DFN100X150X50-6N]

### Nets
!HOLD!_N: U5.7(!HOLD) U7.7(GPB7)
!HOLD!_S: U1.7(!HOLD) U3.7(GPB7)
!WP!_N: U5.3(!WP) U7.24(GPB0)
!WP!_SW: U1.3(!WP) U3.24(GPB0)
A_SCL: U7.9(SCL) ; also sheet 4
A_SDA: U7.10(SDA) ; also sheet 4
B_SCL: U3.9(SCL) ; also sheet 4
B_SDA: U3.10(SDA) ; also sheet 4
CDONE_N: U6.11(CDONE) U7.2(GPB2)
CDONE_S: U2.11(CDONE) U3.2(GPB2)
CRESET_N: U6.10(CRESET_B) U7.1(GPB1)
CRESET_S: U2.10(CRESET_B) U3.1(GPB1)
E_EN: U6.23(IOR_39) ; also sheet 3
E_SCK: U6.29(IOT_49) ; also sheet 3
E_SCL: U6.19(IOR_35) ; also sheet 3
E_SDA: U6.18(IOR_34) ; also sheet 3
E_SDI: U6.22(IOR_38) ; also sheet 3
E_SDO: U6.20(IOR_36) ; also sheet 3
GND: C1.2 C2.2 C3.2 C4.2 R2.2 R4.2 U1.4(VSS) U2.3(GND) U2.21(GND) U2.EP U3.23(VSS) U4.3(GND) U5.4(VSS) U6.3(GND) U6.21(GND) U6.EP U7.23(VSS) U8.3(GND) ; also sheet 1,3,4
GPA0_E: U7.15(GPA0) ; also sheet 4
GPA0_W: U3.15(GPA0) ; also sheet 4
GPA1_E: U7.16(GPA1) ; also sheet 4
GPA1_W: U3.16(GPA1) ; also sheet 4
GPA2_E: U7.17(GPA2) ; also sheet 4
GPA2_W: U3.17(GPA2) ; also sheet 4
GPA3_E: U7.18(GPA3) ; also sheet 4
GPA3_W: U3.18(GPA3) ; also sheet 4
GPA4_E: U7.19(GPA4) ; also sheet 4
GPA4_W: U3.19(GPA4) ; also sheet 4
GPA5_E: U7.20(GPA5) ; also sheet 4
GPA5_W: U3.20(GPA5) ; also sheet 4
GPA6_E: U7.21(GPA6)
GPA6_W: U3.21(GPA6)
GPA7_E: U7.22(GPA7)
GPA7_W: U3.22(GPA7)
IOL_2A_N: U6.2(IOL_2A) ; also sheet 4
IOL_2A_S: U2.2(IOL_2A) ; also sheet 4
IOL_2B_N: U6.1(IOL_2B) ; also sheet 4
IOL_2B_S: U2.1(IOL_2B) ; also sheet 4
IOL_4A_N: U6.5(IOL_4A) ; also sheet 4
IOL_4A_S: U2.5(IOL_4A) ; also sheet 4
IOL_4B_N: U6.6(IOL_4B) ; also sheet 4
IOL_4B_S: U2.6(IOL_4B) ; also sheet 4
IOL_5A_N: U6.8(IOL_5A) ; also sheet 4
IOL_5A_S: U2.8(IOL_5A) ; also sheet 4
IOL_5B_N: U6.7(IOL_5B) ; also sheet 4
IOL_5B_S: U2.7(IOL_5B) ; also sheet 4
M_V_NW: C1.1 R1.1 U1.8(VCC) U2.4(VCCIO_3) U2.9(VCCIO_2) U2.16(VCC_SPI) U2.17(VCCIO_1) U2.24(VPP_2V5) U2.28(VCCIO_0) U3.8(VDD) U3.12(!RESET) U4.4(EN) U4.6(IN) ; also sheet 4
M_V_SE: C3.1 R3.1 U5.8(VCC) U6.4(VCCIO_3) U6.9(VCCIO_2) U6.16(VCC_SPI) U6.17(VCCIO_1) U6.24(VPP_2V5) U6.28(VCCIO_0) U7.8(VDD) U7.12(!RESET) U8.4(EN) U8.6(IN) ; also sheet 4
N$9: R3.2 R4.1 U7.11(ADDR)
N$200: R1.2 R2.1 U3.11(ADDR)
N_SCK: U6.32(IOT_52) ; also sheet 3
N_SCL: U6.27(IOT_47) ; also sheet 3
N_SDA: U6.26(IOT_45) ; also sheet 3
N_SDI: U6.30(IOT_50) ; also sheet 3
N_SDO: U6.31(IOT_53) ; also sheet 3
S_SCK: U2.32(IOT_52) ; also sheet 3
S_SCL: U2.27(IOT_47) ; also sheet 3
S_SDA: U2.26(IOT_45) ; also sheet 3
S_SDI: U2.30(IOT_50) ; also sheet 3
S_SDO: U2.31(IOT_53) ; also sheet 3
SCK_N: U5.6(SCK) U6.15(IOB_26_SCK) U7.6(GPB6)
SCK_S: U1.6(SCK) U2.15(IOB_26_SCK) U3.6(GPB6)
SDI_N: U5.5(SI) U6.13(IOB_25_SDI) U7.4(GPB4)
SDI_S: U1.5(SI) U2.13(IOB_25_SDI) U3.4(GPB4)
SDO_N: U5.2(SO) U6.12(IOB_24_SDO) U7.3(GPB3)
SDO_S: U1.2(SO) U2.12(IOB_24_SDO) U3.3(GPB3)
SS_N: U5.1(!CE) U6.14(IOB_27_SS) U7.5(GPB5)
SS_S: U1.1(!CE) U2.14(IOB_27_SS) U3.5(GPB5)
TCK: U2.29(IOT_49) ; also sheet 3
TDI: U2.22(IOR_38) ; also sheet 3
TDO: U2.20(IOR_36) ; also sheet 3
TMS: U2.23(IOR_39) ; also sheet 3
V12_NW: C2.1 U2.25(VCC) U4.1(OUT)
V12_SE: C4.1 U6.25(VCC) U8.1(OUT)
W_SCL: U2.19(IOR_35) ; also sheet 3
W_SDA: U2.18(IOR_34) ; also sheet 3
Unconnected: U3.13(INTB) U3.14(INTA) U7.13(INTB) U7.14(INTA)

## Library data of the parts
C1-C5 C5' C6 C6' C7 C7' C8 C8' C9 C9' C10 C10' C11 C11' C12 C12' = generic-rcl:C
HDR-NE HDR-NW HDR-SE HDR-SW = pinhead-2:PINHD-2X06: PIN HEADER
M-LVDS MP-NW MP-SW = pincon:PINHD-1X02: PIN HEADER
MP-NE MP-SE SPI-E SPI-W = pincon:PINHD-1X03: PIN HEADER
PB-NW PB-SE = df12:DF12(XX)-20DP-0.5V
PCIE-NORTH PCIE-SOUTH = PCIe:PCIE-36
PWR-NE PWR-NW PWR-SE PWR-SW = pincon:PINHD-2X02
R1-R4 = generic-rcl:R
U1 U5 = flash:SST25VF020B
U2 U6 = iCE40:ICE40_LP384
U3 U7 = microchip-exp:MCP23018: http://ww1.microchip.com/downloads/en/DeviceDoc/22103a.pdf Source: http://ww1.microchip.com/downloads/en/DeviceDoc/22103a.pdf Adopted by RobG
U4 U8 = ldo:LD6806F
U$1 U$2 U$11 U$14-U$22 = pinpad:PINPAD
X-EAST X-WEST = fx10:FX10-100/10
ZED1 = microzed:µZ-FCI

## Net classes
0 default: width 0.152 mm, drill 0.254 mm
1 power: width 0.152 mm, drill 0.254 mm